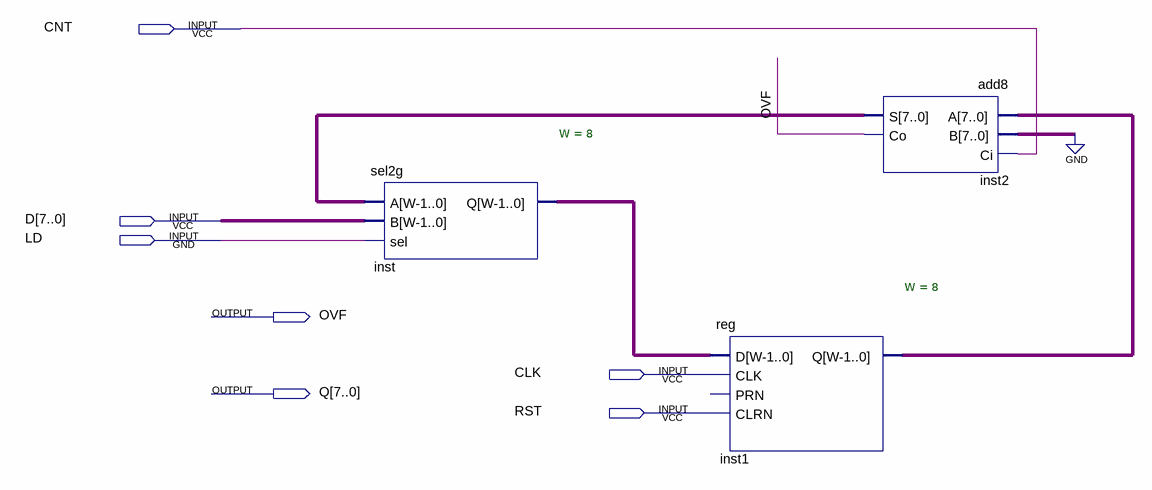
[diagram p0: schematic sheet]
// Quartus schematic cnt8_2.bdf as structural Verilog: 3 symbols, 7 pins
module cnt8_2 (
  input  CNT,
  input  [7:0] D,
  input  LD,
  input  CLK,
  input  RST,
  output OVF,
  output [7:0] Q
);

  wire [7:0] inst1_q, inst2_s, inst_q;

  sel2g #(.W(8)) inst (.A(inst2_s), .B(D), .sel(LD), .Q(inst_q));
  \reg  #(.W(8)) inst1 (.D(inst_q), .CLK(CLK), .CLRN(RST), .Q(inst1_q));  // open: PRN
  add8 inst2 (.A(inst1_q), .B({8{1'b0}}), .Ci(CNT), .S(inst2_s), .Co(OVF));
endmodule
